# EasyEDA Pro project ProPrj_通用工程PCB-Update-V3.1_2025-07-16.epro, board [PCB]Core_Board
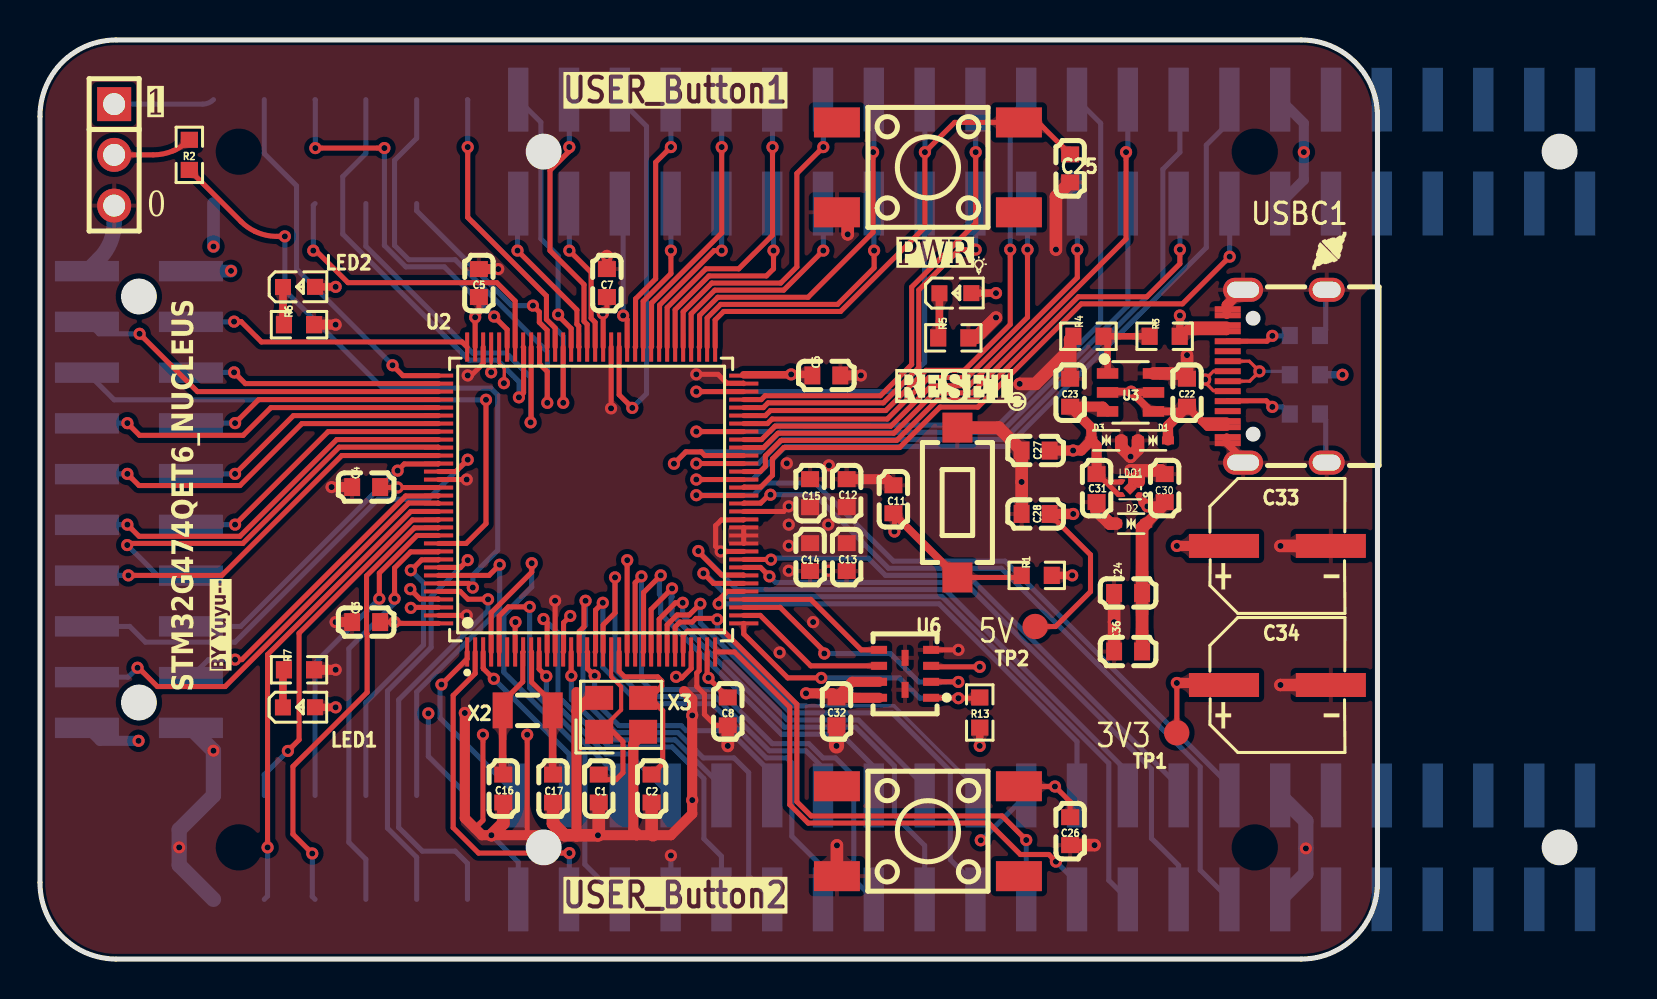
[diagram p7: board, top side]
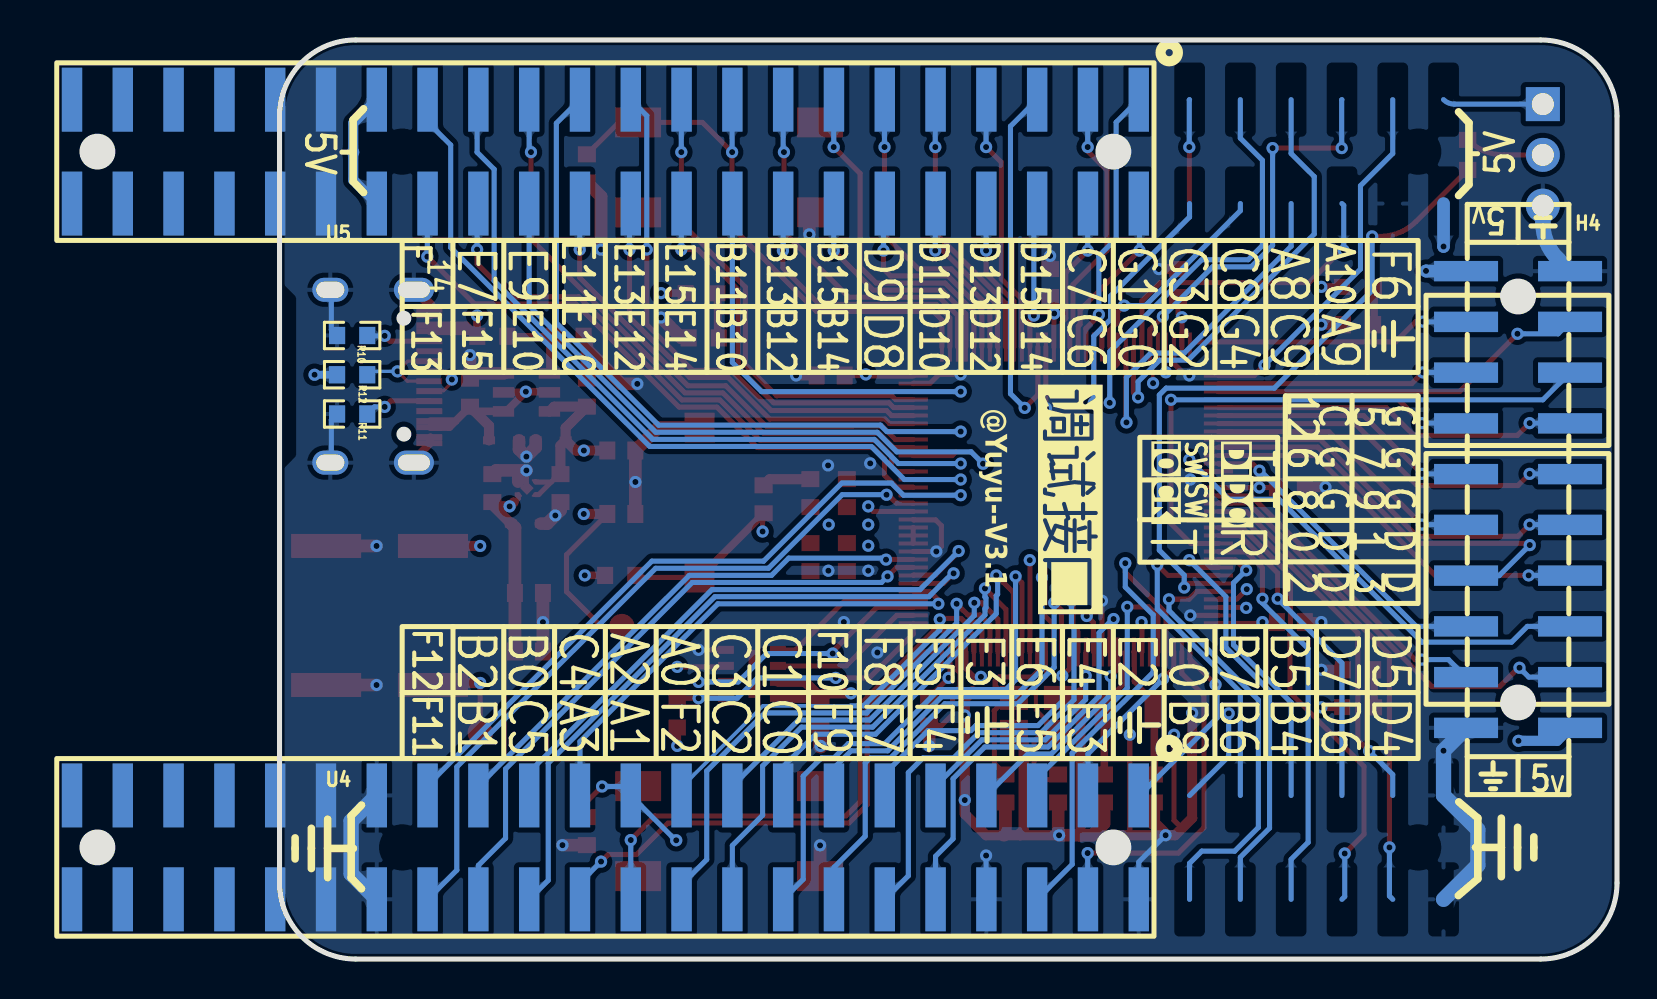
[diagram p8: board, bottom side, seen from below]

Outline 76.88 x 46 mm; copper layers: Top Layer, GND, PWR, Bottom Layer. Coordinates in mm from the lower left corner of the outline.
Outline path: 0,42.19 0,3.81 arc(1.12,1.12) 3.81,0 63.07,0 arc(65.76,1.12) 66.88,3.81 66.88,42.19 arc(65.76,44.88) 63.07,46 3.81,46 arc(1.12,44.88) 0,42.19
Stack: Top Layer 0.035mm 外层铜厚1oz / Dielectric1 0.2104mm 7628 RC49% 8.6mil / GND 0.0152mm 内层铜厚 / Dielectric2 1.065mm 1.1mm H/HOZ Copper / PWR 0.0152mm 内层铜厚 / Dielectric3 0.2104mm 7628 RC49% 8.6mil / Bottom Layer 0.035mm 外层铜厚1oz

## Design rules (mm)
net 8M_IN: DP2
net 8M_OUT: DP2
net L_IN: DP1
net L_OUT: DP1
net USB-DM: DP3
net USB-DP: DP3
net A5-SPI1_CLK: DP4
net A7-SPI1_MOSI: DP4
template: 自定义配置
spacing copperThickness1oz (default): track to track 0.102, other pairs 0.152 to 0.3
spacing copperThickness2oz: track to track 0.203, other pairs 0.152 to 0.3
track width copperThickness1oz (default): min 0.127, default 0.254, max 2.54
track width copperThickness2oz: min 0.203, default 0.254, max 2.54
differential pair differentialPair (default): width min 0.127, default 0.254, max 2.54; gap min 0.152, default 0.152
via viaSize (default): diameter min 0.5, default 0.61, max 10; hole min 0.3, default 0.305, max 6.3
net 3V3 uses copperRegion1

## Placement (name value [footprint] x y rotation side)
C1  20pF  [C0603]  27.94 8.53 90 top
C2  20pF  [C0603]  30.58 8.53 90 top
C3  100nF  [C0603]  16.31 16.87 180 top
C4  100nF  [C0603]  16.31 23.62 180 top
C5  100nF  [C0603]  21.95 33.83 90 top
C6  100nF  [C0603]  39.32 29.21 0 top
C7  100nF  [C0603]  28.35 33.83 90 top
C8  100nF  [C0603]  34.39 12.39 270 top
C11  100nF  [C0603]  42.67 23.01 90 top
C12  1uF  [C0603]  40.34 23.32 90 top
C13  1uF  [C0603]  40.34 20.12 270 top
C14  100nF  [C0603]  38.51 20.12 90 top
C15  10nF  [C0603]  38.51 23.32 90 top
C16  20pF  [C0603]  23.16 8.53 90 top
C17  20pF  [C0603]  25.65 8.53 90 top
C22  10uF  [C0603]  57.35 28.35 270 top
C23  10uF  [C0603]  51.51 28.35 270 top
C24  100nF  [C0603]  54.41 18.32 0 top
C25  100nF  [C0603]  51.51 39.57 270 top
C26  100nF  [C0603]  51.51 6.4 270 top
C27  100nF  [C0603]  49.78 25.45 180 top
C28  100nF  [C0603]  49.78 22.28 180 top
C30  1uF  [C0603]  56.24 23.57 270 top
C31  1uF  [C0603]  52.83 23.57 270 top
C32  100nF  [C0603]  39.83 12.39 270 top
C33  470uF  [CAP-SMD_BD6.3-L6.6-W6.6-FD]  61.87 20.68 0 top
C34  470uF  [CAP-SMD_BD6.3-L6.6-W6.6-FD]  61.87 13.72 0 top
C36  100nF  [C0603]  54.41 15.39 0 top
D1  EDS  [SOD-523_L1.2-W0.8-LS1.6-BI]  55.65 25.96 0 top
D2  EDS  [SOD-523_L1.2-W0.8-LS1.6-BI]  54.56 21.79 0 top
D3  EDS  [SOD-523_L1.2-W0.8-LS1.6-BI]  53.32 25.96 180 top
H2  -  [HDR-TH_3P-P2.54-V-M]  3.71 40.25 270 top
H4  HX PZ2.54-2x10P TP-D  [HDR-SMD_20P-P2.54-V-M-R2-C10-S2.54-LS7.5-EH]  4.95 23 270 bottom
LDO1  TPS7A2033PDQNR  [X2SON-4_L1.0-W1.0-P0.65-TL-EP]  54.51 23.57 180 top
LED0  LTST-C191KSKT  [LED0603-RD-YELLOW]  45.77 33.32 0 top
LED1  LTST-C191KSKT  [LED0603-RD-YELLOW]  12.95 12.6 0 top
LED2  LTST-C191KSKT  [LED0603-RD-YELLOW]  12.95 33.64 0 top
R1  10K  [R0603]  49.84 19.2 0 top
R2  10K  [R0603]  7.47 40.25 270 top
R3  100K  [R0603]  56.24 31.17 0 top
R4  30K  [R0603]  52.43 31.17 0 top
R5  1K  [R0603]  45.67 31.09 0 top
R6  1K  [R0603]  12.95 31.75 0 top
R7  1K  [R0603]  12.95 14.48 0 top
R10  5.1K  [R0603]  63.25 31.21 180 bottom
R11  5.1K  [R0603]  63.25 27.28 180 bottom
R12  1.5K  [R0603]  63.25 29.24 0 bottom
R13  10K  [R0603]  46.99 12.34 270 top
SW0  ZX-QC36-4.3TPWD  [KEY-SMD_L6.0-W3.5-LS8.0]  45.87 22.85 90 top
TP1  -  [Test-Point-0.5mm]  56.84 11.32 0 top
TP2  -  [Test-Point-0.5mm]  49.76 16.64 0 top
U2  STM32G474QET6  [LQFP-128_L14.0-W14.0-P0.40-LS16.0-BL]  27.56 23 0 top
U3  PW2609  [SOT-23-6_L2.9-W1.6-P0.95-LS2.8-BL]  54.53 28.36 270 top
U4  -  [贴片排针-定位柱 2x22p]  35.34 5.59 0 bottom
U5  -  [贴片排针-定位柱 2x22p]  35.34 40.41 0 bottom
U6  W25Q64JWUUIQ  [USON-8_L4.0-W3.0-P0.80-BL_WINBOND_UU]  43.26 14.27 90 top
USBC1  TYPE-C-31-M-12  [USB-C_SMD-TYPE-C-31-M-12]  61.86 29.17 90 top
USW1  KH-6X6X5H-STM  [SW-SMD_4P-L6.0-W6.0-P4.50-LS9.0_H5.0]  44.4 39.62 180 top
USW2  KH-6X6X5H-STM  [SW-SMD_4P-L6.0-W6.0-P4.50-LS9.0_H5.0]  44.4 6.4 180 top
X2  32.768kHz  [FC-135R_L3.2-W1.5]  24.38 12.45 180 top
X3  8MHz  [CRYSTAL-SMD_4P-L3.2-W2.5-BL]  29.06 12.22 0 top

## Footprints (pads in the part's own frame, mm; a bottom-side part is the same pattern mirrored in y, then rotated)
C0603
  rect 0.8x0.9 smd: 1(-0.7,0) 2(0.7,0)
CAP-SMD_BD6.3-L6.6-W6.6-FD
  rect 3.5x1.2 smd: 1(-2.67,0) 2(2.67,0)
CRYSTAL-SMD_4P-L3.2-W2.5-BL
  rect 1.4x1.2 smd: 1(-1.1,-0.85) 2(1.1,-0.85) 3(1.1,0.85) 4(-1.1,0.85)
FC-135R_L3.2-W1.5
  rect 1x1.8 smd: 1(-1.25,0) 2(1.25,0)
HDR-SMD_20P-P2.54-V-M-R2-C10-S2.54-LS7.5-EH
  rect 1.02x3.2 smd: 1(-11.43,-2.6) 2(-11.43,2.6) 3(-8.89,-2.6) 4(-8.89,2.6) 5(-6.35,-2.6) 6(-6.35,2.6) 7(-3.81,-2.6) 8(-3.81,2.6) 9(-1.27,-2.6) 10(-1.27,2.6) 11(1.27,-2.6) 12(1.27,2.6) 13(3.81,-2.6) 14(3.81,2.6) 15(6.35,-2.6) 16(6.35,2.6) 17(8.89,-2.6) 18(8.89,2.6) 19(11.43,-2.6) 20(11.43,2.6)
HDR-TH_3P-P2.54-V-M
  rect 1.7x1.7 hole 1.1: 1(-2.54,0)
  round 1.7 hole 1.1: 2(0,0) 3(2.54,0)
KEY-SMD_L6.0-W3.5-LS8.0
  rect 1.5x1.5 smd: 1(-3.75,0) 2(3.75,0)
LED0603-RD-YELLOW
  rect 0.8x0.8 smd: 1(-0.799,-0.004) 2(0.799,0.004)
LQFP-128_L14.0-W14.0-P0.40-LS16.0-BL
  rect 0.2x1.46 smd: 1(-6.2,-7.63) 2(-5.8,-7.63) 3(-5.4,-7.63) 4(-5,-7.63) 5(-4.6,-7.63) 6(-4.2,-7.63) 7(-3.8,-7.63) 8(-3.4,-7.63) 9(-3,-7.63) 10(-2.6,-7.63) 11(-2.2,-7.63) 12(-1.8,-7.63) 13(-1.4,-7.63) 14(-1,-7.63) 15(-0.6,-7.63) 16(-0.2,-7.63) 17(0.2,-7.63) 18(0.6,-7.63) 19(1,-7.63) 20(1.4,-7.63) 21(1.8,-7.63) 22(2.2,-7.63) 23(2.6,-7.63) 24(3,-7.63) 25(3.4,-7.63) 26(3.8,-7.63) 27(4.2,-7.63) 28(4.6,-7.63) 29(5,-7.63) 30(5.4,-7.63) 31(5.8,-7.63) 32(6.2,-7.63) 65(6.2,7.63) 66(5.8,7.63) 67(5.4,7.63) 68(5,7.63) 69(4.6,7.63) 70(4.2,7.63) 71(3.8,7.63) 72(3.4,7.63) 73(3,7.63) 74(2.6,7.63) 75(2.2,7.63) 76(1.8,7.63) 77(1.4,7.63) 78(1,7.63) 79(0.6,7.63) 80(0.2,7.63) 81(-0.2,7.63) 82(-0.6,7.63) 83(-1,7.63) 84(-1.4,7.63) 85(-1.8,7.63) 86(-2.2,7.63) 87(-2.6,7.63) 88(-3,7.63) 89(-3.4,7.63) 90(-3.8,7.63) 91(-4.2,7.63) 92(-4.6,7.63) 93(-5,7.63) 94(-5.4,7.63) 95(-5.8,7.63) 96(-6.2,7.63)
  rect 1.46x0.2 smd: 33(7.63,-6.2) 34(7.63,-5.8) 35(7.63,-5.4) 36(7.63,-5) 37(7.63,-4.6) 38(7.63,-4.2) 39(7.63,-3.8) 40(7.63,-3.4) 41(7.63,-3) 42(7.63,-2.6) 43(7.63,-2.2) 44(7.63,-1.8) 45(7.63,-1.4) 46(7.63,-1) 47(7.63,-0.6) 48(7.63,-0.2) 49(7.63,0.2) 50(7.63,0.6) 51(7.63,1) 52(7.63,1.4) 53(7.63,1.8) 54(7.63,2.2) 55(7.63,2.6) 56(7.63,3) 57(7.63,3.4) 58(7.63,3.8) 59(7.63,4.2) 60(7.63,4.6) 61(7.63,5) 62(7.63,5.4) 63(7.63,5.8) 64(7.63,6.2) 97(-7.63,6.2) 98(-7.63,5.8) 99(-7.63,5.4) 100(-7.63,5) 101(-7.63,4.6) 102(-7.63,4.2) 103(-7.63,3.8) 104(-7.63,3.4) 105(-7.63,3) 106(-7.63,2.6) 107(-7.63,2.2) 108(-7.63,1.8) 109(-7.63,1.4) 110(-7.63,1) 111(-7.63,0.6) 112(-7.63,0.2) 113(-7.63,-0.2) 114(-7.63,-0.6) 115(-7.63,-1) 116(-7.63,-1.4) 117(-7.63,-1.8) 118(-7.63,-2.2) 119(-7.63,-2.6) 120(-7.63,-3) 121(-7.63,-3.4) 122(-7.63,-3.8) 123(-7.63,-4.2) 124(-7.63,-4.6) 125(-7.63,-5) 126(-7.63,-5.4) 127(-7.63,-5.8) 128(-7.63,-6.2)
R0603
  rect 0.806x0.864 smd: 1(-0.753,0) 2(0.753,0)
SOD-523_L1.2-W0.8-LS1.6-BI
  rect 0.6x0.4 smd: 1(-0.75,0) 2(0.75,0)
SOT-23-6_L2.9-W1.6-P0.95-LS2.8-BL
  rect 0.532x1.072 smd: 1(-0.95,-1.149) 2(0,-1.149) 3(0.95,-1.149) 4(0.95,1.149) 5(0,1.149) 6(-0.95,1.149)
SW-SMD_4P-L6.0-W6.0-P4.50-LS9.0_H5.0
  rect 2.3x1.5 smd: 1(-4.55,2.25) 2(4.55,2.25) 3(-4.55,-2.25) 4(4.55,-2.25)
Test-Point-0.5mm
  round 1.27 smd: 1(0,0)
USB-C_SMD-TYPE-C-31-M-12
  oval 1.2x2 hole 0.8x1.6: 0(-4.325,1.706) 1(4.325,1.706)
  oval 1.2x1.8 hole 0.8x1.4: 2(4.325,-2.474) 3(-4.325,-2.474)
  rect 0.3x1.3 smd: A1(-3.35,2.474) A4(-2.55,2.474) A5(-1.25,2.474) A6(-0.25,2.474) A7(0.25,2.474) A8(1.25,2.474) A9(2.55,2.474) A12(3.35,2.474) B1(3.05,2.474) B4(2.25,2.474) B5(1.75,2.474) B6(0.75,2.474) B7(-0.75,2.474) B8(-1.75,2.474) B9(-2.25,2.474) B12(-3.05,2.474)
USON-8_L4.0-W3.0-P0.80-BL_WINBOND_UU
  rect 0.4x0.8 smd: 1(-1.2,-1.3) 2(-0.4,-1.3) 3(0.4,-1.3) 4(1.2,-1.3) 5(1.2,1.3) 6(0.4,1.3) 7(-0.4,1.3) 8(-1.2,1.3)
  rect 0.8x0.35 smd: 9(-0.802,0) 10(0.798,0)
X2SON-4_L1.0-W1.0-P0.65-TL-EP
  custom 0.36x0.22 smd: 1(-0.43,0.325) 2(-0.43,-0.325) 3(0.43,-0.325) 4(0.43,0.325)
  rect 0.48x0.48 smd rot 45: 5(0,0)
贴片排针-定位柱 2x22p
  rect 1.02x3.2 smd: 1(-11.43,-2.6) 2(-8.89,-2.6) 3(-6.35,-2.6) 4(-3.81,-2.6) 5(-1.27,-2.6) 6(1.27,-2.6) 7(3.81,-2.6) 8(6.35,-2.6) 9(8.89,-2.6) 10(11.43,-2.6) 11(13.97,-2.6) 12(16.51,-2.6) 13(19.05,-2.6) 14(21.59,-2.6) 15(24.13,-2.6) 16(26.67,-2.6) 17(29.21,-2.6) 18(31.75,-2.6) 19(34.29,-2.6) 20(36.83,-2.6) 21(39.37,-2.6) 22(41.91,-2.6) 23(-11.43,2.6) 24(-8.89,2.6) 25(-6.35,2.6) 26(-3.81,2.6) 27(-1.27,2.6) 28(1.27,2.6) 29(3.81,2.6) 30(6.35,2.6) 31(8.89,2.6) 32(11.43,2.6) 33(13.97,2.6) 34(16.51,2.6) 35(19.05,2.6) 36(21.59,2.6) 37(24.13,2.6) 38(26.67,2.6) 39(29.21,2.6) 40(31.75,2.6) 41(34.29,2.6) 42(36.83,2.6) 43(39.37,2.6) 44(41.91,2.6)

## Nets
As in the schematic.

Pads without a net: U2 6; USBC1 A8 B8; USW1 1 4; USW2 1 4

## Via types
v1: diameter 0.61, hole 0.305, Top Layer to Bottom Layer, 192 vias

## Routing (per net, layer and track width the routed paths; a pad name or vN(x,y) marks a point on that pad's centre or on a via; arc(x,y) is an arc through that point)
3V3: length 52.2
  Top Layer w0.254: U2.95 v1(21.76,32.12) 21.95,32.31 C5.1 ; C3.1 v1(17.73,16.87) 17.79,16.8 U2.128 ; C7.1 28.35,32.51 v1(28.14,32.31) 28.16,32.29 U2.79 ; TP1.1 56.84,11.33 v1(56.84,13.82) ; C8.1 33.42,14.06 v1(33.42,14.07) 33.36,14.14 U2.31 ; U2.111 v1(17.88,23.6) 17.03,23.6 C4.1 ; U2.47 37.18,22.4 v1(37.44,22.66) ; U2.13 26.18,15.39 26.18,16.84 v1(26.51,17.17) ; v1(46.99,14.62) 44.61,14.62 U6.3 ; LDO1.1 54.94,23.05 55.13,22.86 55.17,22.86 ; U2.43 U2.44 U2.45
  Top Layer w0.381: LED0.2 v1(47.8,33.33) ; R13.2 v1(46.99,10.67) ; 35.19,29.24 37.54,29.24 v1(37.56,29.26) 38.57,29.26 C6.1 ; R1.2 v1(51.61,19.2)
  Top Layer w0.508: C33.1 v1(56.84,20.68) ; D2.2 56.24,22.72 C30.2 56.02,22.66 v1(55.37,22.66) 55.17,22.86 ; U6.7 40.61,13.87 C32.1 39.62,13.3 v1(38.3,13.3) ; v1(56.84,13.82) 59.1,13.82 C34.1 ; U6.8 39.85,13.07
  Top Layer w0.635: D2.2 55.11,21.59 C24.2 C36.2
  Bottom Layer w0.381: R12.2 v1(65.13,29.24)
  vias: v1(37.44,21.74) v1(37.44,20.69) v1(39.42,21.74)
5V: length 20.1
  Top Layer w0.254: C31.1 52.89,24.27 53.29,23.87 ; LDO1.3 54.06,23.87 53.29,23.87 ; LDO1.4 53.92,23.25 53.29,23.87 ; C28.1 52.53,20.23 52.53,18.39 50.78,16.64 TP2.1
  Top Layer w0.508: C28.1 v1(51.66,22.28) ; D3.2 52.06,25.45 v1(51.66,25.45) C27.1 ; D3.2 52.57,26.59 C23.2 53.14,27.65 U3.3 ; D3.2 52.83,25.7 C31.1
GND: length 163.3
  Top Layer w0.254: U2.110 v1(21.34,24) ; U2.12 25.76,17.93 v1(25.76,17.93) ; v1(24.36,11.23) 24.36,6.21 24.38,6.2 ; 21.75,6.55 22.15,6.95 v1(22.15,11.23) ; 44.56,15.47 v1(45.92,15.47) ; U2.94 22.16,29.81 21.56,29.21 v1(21.39,29.21) ; v1(28.55,27.56) 28.56,27.57 U2.78 ; C8.2 33.77,11.69 33.22,12.24 33.22,13.26 32.84,13.64 32.84,14.32 32.96,14.43 U2.30 ; U2.127 v1(21.34,17.2) ; v1(54.53,24.45) 54.53,24.13 54.54,24.12 54.54,23.81 54.53,23.8 54.53,23.59 LDO1.5 ; v1(32.82,29.26) 33.9,29.26 34.34,28.82 35.17,28.82 U2.63 ; U2.42 v1(34.04,20.4) 33.78,20.65 33.78,21.69 34.07,21.98 35.17,21.98 U2.46
  Top Layer w0.381: 59.34,26.12 59.34,25.82 60.11,25.05 60.11,24.85 ; 59.34,32.22 59.34,32.52
  Top Layer w0.508: X3.2 30.16,11.27 29.67,10.78 29.67,6.47 29.84,6.3 29.84,6.2 ; X3.4 27.49,13.07 26.83,12.41 ; R6.2 v1(14.78,31.75) ; C11.2 42.37,24.02 C12.2 ; 26.23,6.2 v1(22.57,6.2) 22.1,6.2 21.24,7.05 v1(21.24,12.32) ; C5.2 v1(22.91,34.53) ; 26.83,12.41 26.83,13.36 ; 26.83,12.41 26.83,6.2 ; C4.2 v1(14.58,23.62) ; 32.21,13.41 32.61,13 v1(32.61,12.19) v1(32.61,7.96) 32.61,7.26 31.55,6.2 29.84,6.2 ; 29.84,6.2 29.83,6.19 v1(27.9,6.19) ; 59.34,32.52 59.34,32.73 60.11,33.5 ; C3.2 v1(14.78,16.87) ; R7.2 v1(14.78,14.48) ; C7.2 v1(28.35,35.19) ; 40.02,29.21 v1(41.05,29.21)
  Top Layer w0.635: 39.85,4.15 v1(39.85,5.69) ; C8.2 v1(34.39,10.67) ; C33.2 v1(62.03,20.68) ; 51.51,30.52 51.51,31.01 R4.1 ; 51.51,30.52 C23.1 ; 51.51,30.52 49.78,28.79 v1(48.99,28.79) ; v1(57.35,30.23) C22.1 57.09,29.31 55.68,29.31 ; D3.1 54.07,25.61 v1(54.53,25.15) 54.9,25.52 D1.1 ; C31.2 52.83,22.45 v1(53.09,22.2) 53.49,21.79 53.81,21.79 ; v1(50.8,35.51) 50.8,38.16 C25.2 ; C28.2 v1(49.08,23.88) C27.2 47.94,26.6 45.87,26.6 ; C24.1 v1(53.71,16.86) C36.1 ; C30.1 56.05,24.45 v1(54.53,24.45) 54.94,24.05 LDO1.2 ; C2.1 30.58,6.27 30.65,6.2 ; C17.1 25.65,6.78 26.23,6.2 26.83,6.2 26.83,6.19 v1(27.9,6.19) 27.94,6.24 C1.1 ; v1(22.57,6.2) 23.16,6.79 C16.1 ; R5.2 46.79,31.09 v1(47.8,32.11) ; C34.2 v1(62.03,13.72) ; 39.85,37.37 40.39,36.84 v1(40.39,36.27) ; C26.2 v1(52.73,5.7)
  Top Layer w0.762: C32.2 v1(39.83,10.67)
  Bottom Layer w0.254: v1(22.57,6.2) 23.91,4.85 U4.23 ; 64.29,24.85 64.29,26.99 R11.1 ; R10.1 64.29,31.5 64.29,33.5 ; 31.53,2.99 31.55,3 v1(31.55,5.18)
  Bottom Layer w0.762: H4.19 7.55,11.55 v1(8.67,10.43) 8.67,8.19 6.96,6.47 v1(6.96,5.59) 6.96,4.7 8.67,2.99 ; H4.2 2.96,35.05 arc(3.52,35.87) 3.71,36.84 H2.3 ; 62.01,2.99 63.3,4.27 v1(63.3,5.54) 63.3,6.9 62.01,8.19
  vias: v1(36.98,15.34) v1(37.34,24.81) v1(37.44,19.44) v1(38.66,16.87) v1(39.45,24.71) v1(39.43,19.44)
VCC: length 34.5
  Top Layer w0.381: 59.34,31.72 57.54,31.72 57.23,31.41 59.33,31.41 59.34,31.42 ; v1(57,32.21) 57,31.18 R3.2 ; 55.68,28.36 54.6,28.36 55.55,27.41 57.12,27.41 ; U3.2 53.42,28.4 v1(54.56,28.4) ; 58.08,26.92 C22.2 ; 58.08,26.92 59.34,26.92 ; 58.08,26.92 58.38,26.62 59.34,26.62
  Top Layer w0.508: D1.2 56.4,26.69 57.12,27.41 C22.2
  Bottom Layer w0.254: H2.1 8.13,42.79 arc(8.43,42.85) 8.67,43.01
  Bottom Layer w0.508: 62.01,37.81 63.19,38.99 v1(63.19,40.39) 63.19,41.83 62.01,43.01 ; v1(4.93,10.92) 3,10.92 H4.20
  Bottom Layer w0.635: v1(9.55,34.44) 9.54,34.43 H4.1 ; 8.67,37.81 v1(8.67,35.66)
8M_IN: length 9.1
  Top Layer w0.203: U2.19 28.56,14.13 29.06,13.63 29.06,12.47 X3.1
  Top Layer w0.254: X3.1 28.66,11.37 29.15,10.88 29.15,9.32 28.8,8.98 28.19,8.98 C1.2
8M_OUT: length 9.1
  Top Layer w0.254: X3.3 30.5,13.07 ; 30.5,13.07 31.09,13.66 31.09,13.92 30.89,14.12 29.23,14.12 28.96,14.4 U2.20 ; 30.5,13.07 31.14,12.43 31.14,9.79 C2.2
A0: length 20.7
  Top Layer w0.254: U2.27 31.76,16.62 32,16.86 32.61,16.86 32.79,17.05 33.81,17.05 v1(33.86,17)
  Bottom Layer w0.178: 46.77,8.19 46.77,8.6 42.7,12.67 38.3,12.67
  Bottom Layer w0.254: 38.3,12.67 37.66,12.67 33.86,16.47 v1(33.86,17)
A1: length 28.2
  Top Layer w0.254: U2.28 32.16,16.19 32.38,16.41 34.18,16.41 37.85,12.75 37.85,7.87 38.56,7.16 48.11,7.16 v1(49.31,5.96)
  Bottom Layer w0.254: v1(49.31,5.96) 49.31,2.99
A2: length 28.9
  Top Layer w0.254: v1(31.81,14.12) 31.86,14.07 32.09,14.07 32.56,14.54 U2.29 ; USW2.3 48.96,8.64 v1(50.75,8.64) 51.51,7.87 C26.1
  GND w0.254: v1(31.81,14.12) 32.51,14.12 33.53,13.11 35.66,13.11 42.82,5.94 v1(47.04,5.94)
  Bottom Layer w0.254: v1(47.04,5.94) 47.07,5.94 49.31,8.19 49.76,8.64 v1(50.75,8.64)
A3: length 26.6
  Top Layer w0.254: v1(50.8,4.88) 50.44,5.23 49.02,5.23 47.45,6.81 38.41,6.81 37.49,7.73 37.49,12.6 34.72,15.37 U2.32
  Bottom Layer w0.254: 51.85,2.99 51.85,3.82 v1(50.8,4.88)
A4-SPI1_NSS: length 15.1
  Top Layer w0.254: v1(39.06,14.07) 37.39,14.07 35.19,16.27 U2.33 ; U6.1 45.9,13.07 v1(45.92,13.06) 46.95,13.06 R13.1
  Bottom Layer w0.254: v1(39.06,14.07) 42.98,14.07 43.99,13.06 v1(45.92,13.06)
A5-SPI1_CLK: length 7.8
  Top Layer w0.254: U6.6 38.54,14.67 36.01,17.2 U2.34
A6-SPI1_MISO: length 13.7
  Top Layer w0.254: v1(45.92,13.87) 45.92,13.87 U6.2 ; v1(39.22,15.29) 39.22,15.39 37.01,17.6 U2.35
  Bottom Layer w0.254: v1(45.92,13.87) 43.94,13.87 42.52,15.29 v1(39.22,15.29)
A7-SPI1_MOSI: length 7.8
  Top Layer w0.254: U2.36 38.54,18 41.07,15.47 41.96,15.47
A8: length 22.5
  Top Layer w0.254: v1(23.95,28.11) 24.18,28.35 24.18,30.61 U2.89
  Bottom Layer w0.254: v1(23.95,28.11) 23.95,28.9 22.87,29.97 21.45,29.97 15.14,36.28 15.14,39.16 16.29,40.32 16.29,43.01
A9: length 15.8
  Top Layer w0.254: v1(13.67,35.46) 13.79,35.46 15.4,33.85 22.84,33.85 23.76,32.93 U2.90
  Bottom Layer w0.254: v1(13.67,35.46) 13.67,37.72 13.75,37.81
A10: length 19.5
  Top Layer w0.254: v1(22.71,32.16) 23.36,31.5 U2.91 ; v1(17.22,40.59) v1(13.77,40.59)
  Bottom Layer w0.254: v1(13.77,40.59) 13.77,43 13.75,43.01 ; v1(17.22,40.59) 17.22,35.72 18.29,34.64 20.22,34.64 v1(22.71,32.16)
B0: length 30
  Top Layer w0.254: U2.39 35.17,19.22 34.08,19.22 32.92,20.38 v1(32.92,20.42)
  Bottom Layer w0.254: 54.39,8.19 54.39,9.35 45.25,18.49 34.85,18.49 v1(32.92,20.42)
B1: length 31.7
  Top Layer w0.254: v1(36.47,19.15) 36.03,19.6 U2.40
  Bottom Layer w0.254: 56.93,2.99 56.93,4.69 55.57,6.04 55.57,9.51 46.24,18.85 36.78,18.85 v1(36.47,19.15)
B2: length 27
  Top Layer w0.254: v1(36.55,19.99) 36.54,20 U2.41
  Bottom Layer w0.254: 56.93,8.19 56.93,8.66 46.39,19.2 42.28,19.2 41.41,20.07 36.63,20.07 v1(36.55,19.99)
B4: length 20.4
  Top Layer w0.254: U2.119 19.91,20.38 18.53,20.38 17.73,19.58 v1(17.73,18.03)
  Bottom Layer w0.254: 16.29,2.99 16.29,4.99 15.44,5.84 15.44,15.53 17.73,17.82 v1(17.73,18.03)
B5: length 14.3
  Top Layer w0.254: v1(18.54,19.46) 18.56,19.46 19.08,19.98 19.91,19.98 U2.120
  Bottom Layer w0.254: 16.29,8.19 16.29,12.84 19.18,15.72 19.18,18.82 v1(18.54,19.46)
B6: length 20.9
  Top Layer w0.254: U2.121 21.02,19.6 v1(21.39,19.96)
  Bottom Layer w0.254: v1(21.39,19.96) 19.56,18.14 19.56,15.6 17.37,13.42 17.37,6.55 18.83,5.09 18.83,2.99
B7: length 16.5
  Top Layer w0.254: U2.122 19.93,19.2 22.45,19.2 v1(22.99,19.74)
  Bottom Layer w0.254: v1(22.99,19.74) 22.99,17.52 18.83,13.37 18.83,8.19
B9: length 21.9
  Top Layer w0.254: U2.124 21.01,18.4 21.4,18.01 22.4,18.01 v1(22.4,18)
  Bottom Layer w0.254: 21.37,2.99 21.37,4.79 20.76,5.4 19.12,5.4 17.93,6.58 17.93,12.97 22.4,17.44 v1(22.4,18)
B10: length 22.3
  Top Layer w0.254: U2.62 v1(32.82,28.4)
  Bottom Layer w0.254: 44.23,37.81 44.23,29.86 42.78,28.4 v1(32.82,28.4)
B11: length 28.7
  Top Layer w0.254: C25.1 49.91,41.87 USW1.3 45.74,41.87 v1(44.25,40.39) 44.25,36.63 40.03,32.41 34.18,32.41 33.76,31.99 U2.65
  Bottom Layer w0.254: 44.23,43.01 44.25,43 v1(44.25,40.39)
B12: length 14.1
  Top Layer w0.254: U2.66 33.36,32.09 34.04,32.77 39.88,32.77 41.71,34.59 v1(41.71,35.46)
  Bottom Layer w0.254: v1(41.71,35.46) 41.69,35.47 41.69,37.81
B13: length 18.6
  Top Layer w0.254: U2.67 32.98,30.65 32.98,32.21 33.89,33.12 38.41,33.12 41.66,36.37 v1(41.66,40.39)
  Bottom Layer w0.254: 41.69,43.01 41.69,40.42 v1(41.66,40.39)
B14: length 11.9
  Top Layer w0.254: v1(39.17,35.46) 37.19,33.48 33.74,33.48 32.56,32.3 U2.68
  Bottom Layer w0.254: v1(39.17,35.46) 39.17,37.8 39.15,37.81
B15: length 17.3
  Top Layer w0.254: v1(39.17,40.64) 37.85,39.32 37.85,34.64 37.04,33.83 33.59,33.83 32.16,32.4 U2.69
  Bottom Layer w0.254: v1(39.17,40.64) 39.17,43 39.15,43.01
BOOT0: length 33.5
  Top Layer w0.254: R2.2 10.05,36.91 arc(10.38,36.64) 10.75,36.42 arc(11.28,36.23) 11.84,36.17 v1(12.24,36.17) ; U2.123 21.43,18.8 v1(21.64,18.59)
  Bottom Layer w0.254: v1(12.24,36.17) 12.24,33.46 17.13,28.57 22.54,28.57 22.88,28.23 22.88,20.46 21.64,19.22 v1(21.64,18.59)
C0: length 28.3
  Top Layer w0.254: v1(30.07,19.15) 29.76,18.84 U2.22
  Bottom Layer w0.254: 41.69,2.99 40.69,3.99 40.69,9.16 39.78,10.07 39.15,10.07 38.44,10.78 36.62,10.78 33.91,13.49 30.55,13.49 30.07,13.97 v1(30.07,19.15)
C1: length 21.4
  Top Layer w0.254: U2.23 30.18,15.39 30.18,18.34 v1(31.04,19.2)
  Bottom Layer w0.254: v1(31.04,19.2) 30.97,19.13 30.97,18.26 31.04,18.19 31.04,17.28 37.07,11.25 40.07,11.25 41.69,9.63 41.69,8.19
C2: length 26.5
  Top Layer w0.254: v1(31.6,18.55) 30.56,17.5 U2.24
  Bottom Layer w0.254: 44.23,2.99 44.23,5.68 42.72,7.19 42.72,9.66 40.78,11.61 37.22,11.61 31.6,17.22 31.6,17.54 31.55,17.59 31.55,18.07 31.6,18.12 v1(31.6,18.55)
C3: length 19.9
  Top Layer w0.254: v1(32.14,17.83) 31.78,17.83 30.96,17.01 U2.25
  Bottom Layer w0.254: 44.23,8.19 44.23,8.66 40.93,11.96 37.37,11.96 32.14,17.19 v1(32.14,17.83)
C4: length 25.1
  Top Layer w0.254: v1(33.93,17.78) 33.93,17.97 34.36,18.4 U2.37
  Bottom Layer w0.254: v1(33.93,17.78) 44.96,17.78 51.85,10.88 51.85,8.19
C5: length 33.6
  Top Layer w0.254: U2.38 33.68,18.8 v1(33.17,19.3)
  Bottom Layer w0.254: v1(33.17,19.3) 33.24,19.3 34.4,18.14 45.11,18.14 53.44,9.8 53.44,3.94 54.39,2.99
C6: length 7.7
  Top Layer w0.254: v1(26.47,35.46) 27.56,34.37 27.56,32.07 27.76,31.87 U2.80
  Bottom Layer w0.254: 26.45,37.81 26.47,37.8 v1(26.47,35.46)
C7: length 13.6
  Top Layer w0.254: v1(26.47,40.64) 26.47,40.44 25.5,39.47 25.5,35.46 27.2,33.76 27.2,31.92 27.36,31.76 U2.81
  Bottom Layer w0.254: 26.45,43.01 26.47,43 v1(26.47,40.64)
C8: length 23.1
  Top Layer w0.254: U2.87 24.98,30.61 24.98,29.78 25.37,29.4 v1(25.37,27.84)
  Bottom Layer w0.254: v1(25.37,27.84) 25.37,30.4 20.76,35 18.44,35 17.73,35.71 17.73,39.98 18.83,41.08 18.83,43.01
C9: length 19.1
  Top Layer w0.254: v1(24.53,26.86) 24.56,26.89 U2.88
  Bottom Layer w0.254: 16.29,37.81 16.29,35.67 21.64,30.33 23.32,30.33 24.53,29.11 24.53,26.86 v1(24.53,26.86)
C10-UART4_TX: length 12.9
  Top Layer w0.254: U2.100 10.93,28 v1(9.75,26.82)
  Bottom Layer w0.254: v1(9.75,26.82) 7.56,26.82 H4.7
C11-UART4_RX: length 18.4
  Top Layer w0.254: v1(4.37,26.82) 4.98,26.21 10.16,26.21 11.55,27.6 U2.101
  Bottom Layer w0.254: v1(4.37,26.82) 2.36,26.82 H4.8
C12: length 13.6
  Top Layer w0.254: v1(9.75,24.28) 12.67,27.2 U2.102
  Bottom Layer w0.254: v1(9.75,24.28) 7.56,24.28 H4.9
C13: length 23
  Top Layer w0.254: v1(23.77,16.87) 23.76,16.85 U2.7
  Top Layer w0.381: LED2.2 v1(14.78,33.64)
  GND w0.381: v1(14.78,33.64) 23.77,24.65 v1(23.77,16.87)
D0: length 15.8
  Top Layer w0.254: U2.108 19.91,24.78 18.22,24.78 v1(17.88,24.44)
  Bottom Layer w0.254: v1(17.88,24.44) 17.83,24.44 10.04,16.65 H4.15
D1: length 24.9
  Top Layer w0.254: U2.109 20.79,24.4 v1(21.39,24.99)
  Bottom Layer w0.254: v1(21.39,24.99) 19.41,23.01 16.9,23.01 9.75,15.86 5.27,15.86 4.48,16.65 H4.16
D2: length 16.1
  Top Layer w0.254: U2.112 19.91,23.18 18.29,23.18 10.09,14.99 9.6,14.99
  Bottom Layer w0.254: 9.6,14.99 8.42,14.99 H4.17
  vias: v1(9.75,14.99)
D3: length 22
  Top Layer w0.254: U2.113 19.91,22.82 18.44,22.82 9.26,13.64 5.87,13.64 4.93,14.58 v1(4.88,14.58)
  Bottom Layer w0.254: v1(4.88,14.58) 4.41,14.11 H4.18
D4: length 23.8
  Top Layer w0.254: v1(11.38,5.59) 11.38,15.24 18.54,22.4 U2.114
  Bottom Layer w0.254: 11.21,2.99 11.38,3.15 v1(11.38,5.59)
D5: length 18.2
  Top Layer w0.254: U2.115 19.91,21.98 18.62,21.98 12.95,16.31 12.95,10.97 v1(12.39,10.41)
  Bottom Layer w0.254: 11.21,8.19 11.21,9.23 v1(12.39,10.41)
D6: length 22.8
  Top Layer w0.254: U2.116 19.91,21.58 18.72,21.58 16.33,19.18 16.33,16.3 16.36,16.27 16.36,13.35 12.65,9.64 12.65,6.25 v1(13.61,5.28)
  Bottom Layer w0.254: v1(13.61,5.28) 13.61,3.13 13.75,2.99
D7: length 16.2
  Top Layer w0.254: v1(16.97,18.03) 16.97,19.32 18.85,21.2 U2.117
  Bottom Layer w0.254: 13.75,8.19 13.75,14.82 v1(16.97,18.03)
D8: length 10.9
  Top Layer w0.254: v1(36.68,35.46) 36.68,34.55 36.32,34.19 33.45,34.19 31.76,32.5 U2.70
  Bottom Layer w0.254: v1(36.68,35.46) 36.68,37.75 36.61,37.81
D9: length 15.5
  Top Layer w0.254: U2.71 31.36,32.61 33.3,34.55 34.94,34.55 36.63,36.23 v1(36.63,40.64)
  Bottom Layer w0.254: v1(36.63,40.64) 36.63,43 36.61,43.01
D10: length 8.7
  Top Layer w0.254: U2.72 30.98,30.65 30.98,32.73 33.71,35.46 v1(34.09,35.46)
  Bottom Layer w0.254: v1(34.09,35.46) 34.09,37.8 34.07,37.81
D11: length 13.8
  Top Layer w0.254: v1(34.09,40.64) 34.09,36.34 30.58,32.83 30.58,30.65 U2.73
  Bottom Layer w0.254: 34.07,43.01 34.09,43 v1(34.09,40.64)
D12: length 7.8
  Top Layer w0.254: v1(31.55,35.46) 31.55,34.3 30.16,32.92 U2.74
  Bottom Layer w0.254: 31.53,37.81 31.55,37.8 v1(31.55,35.46)
D13: length 13.1
  Top Layer w0.254: v1(31.55,40.64) 30.78,39.88 30.78,34.05 29.78,33.04 29.78,30.65 U2.75
  Bottom Layer w0.254: 31.53,43.01 31.55,43 v1(31.55,40.64)
D14: length 7.3
  Top Layer w0.254: v1(29.16,32.21) 29.36,32.01 U2.76
  Bottom Layer w0.254: 28.99,37.81 29.16,37.65 v1(29.16,32.21)
D15: length 19.6
  Top Layer w0.254: U2.77 28.96,28.24 v1(29.62,27.58)
  Bottom Layer w0.254: 28.99,43.01 30.33,41.68 30.33,28.3 v1(29.62,27.58)
E0: length 13.1
  Top Layer w0.254: v1(18.51,18.51) 19.01,18.02 19.91,18.02 U2.125
  GND w0.254: v1(18.51,18.51) 19.42,17.61 v1(19.42,12.29)
  Bottom Layer w0.254: 21.37,8.19 19.42,10.14 v1(19.42,12.29)
E1: length 9
  Top Layer w0.254: v1(18.54,17.58) 18.56,17.6 U2.126
  Top Layer w0.381: LED1.2 14.78,12.6 v1(14.78,12.6)
  GND w0.381: v1(18.54,17.58) 18.54,16.36 v1(14.78,12.6)
E2: length 9.4
  Top Layer w0.254: U2.1 21.36,15.02 v1(20.07,13.74)
  Bottom Layer w0.254: 23.91,8.19 23.88,8.19 20,12.06 20,13.67 v1(20.07,13.74)
E3: length 17.9
  Top Layer w0.254: v1(26.47,5.3) 21.93,5.3 20.66,6.58 20.66,13.19 21.76,14.29 U2.2
  Bottom Layer w0.254: v1(26.47,5.3) 26.47,3 26.45,2.99
E4: length 9
  Top Layer w0.254: U2.3 22.16,14.56 22.18,14.54 22.18,14.52 22.68,14.03 v1(22.69,14.03)
  Bottom Layer w0.254: 26.45,8.19 26.45,10.27 v1(22.69,14.03)
E5: length 25.1
  Top Layer w0.254: v1(24.59,19.81) 24.59,19.36 22.56,17.33 U2.4
  Bottom Layer w0.254: v1(24.59,19.81) 24.59,18.62 23.19,17.22 23.19,14.36 27.24,10.3 27.24,4.74 28.99,2.99
E6: length 14.8
  Top Layer w0.254: v1(24.49,17.63) 23.42,17.63 22.96,17.17 U2.5
  Bottom Layer w0.254: 28.99,8.19 28.99,9.06 24.49,13.56 v1(24.49,17.63)
E7: length 38.9
  Top Layer w0.254: U2.53 v1(32.82,24.8)
  Bottom Layer w0.254: v1(32.82,24.8) 35.93,24.8 37.14,26.01 48.21,26.01 56.15,33.94 56.15,39.53 57,40.38 57,42.95 56.93,43.01
E8: length 34.9
  Top Layer w0.254: U2.54 33.24,25.2 33.06,25.38 32.29,25.38 v1(31.7,24.79)
  Bottom Layer w0.254: v1(31.7,24.79) 32.29,25.38 36.01,25.38 36.99,26.37 48.07,26.37 54.39,32.69 54.39,37.81
E9: length 30.4
  Top Layer w0.254: U2.55 36.18,25.6 36.9,26.31 42.69,26.31 44.71,28.34 46.6,28.34 54.31,36.04 v1(54.31,40.39)
  Bottom Layer w0.254: v1(54.31,40.39) 54.39,40.47 54.39,43.01
E10: length 23.7
  Top Layer w0.254: v1(51.87,35.51) 51.87,34.1 46.46,28.69 44.56,28.69 42.54,26.67 36.75,26.67 36.08,26 U2.56
  Bottom Layer w0.254: 51.85,37.81 51.87,37.8 v1(51.87,35.51)
E11: length 36.5
  Top Layer w0.254: U2.57 v1(32.82,26.4)
  Bottom Layer w0.254: v1(32.82,26.4) 36.51,26.4 36.83,26.72 47.92,26.72 53.03,31.84 53.03,41.83 51.85,43.01
E12: length 22.1
  Top Layer w0.254: U2.58 36.38,26.8 36.6,27.03 42.37,27.03 44.45,29.11 46.37,29.11 49.38,32.12 v1(49.38,35.51)
  Bottom Layer w0.254: 49.31,37.81 49.38,37.75 v1(49.38,35.51)
E13: length 26.8
  Top Layer w0.254: U2.59 36.27,27.2 36.53,27.45 42.29,27.45 44.3,29.46 46.22,29.46 48.51,31.76 48.51,35.56
  Bottom Layer w0.254: 48.51,35.56 48.51,42.21 49.31,43.01
  vias: v1(48.51,35.51)
E14: length 19.5
  Top Layer w0.254: U2.60 36.17,27.6 36.41,27.84 42.17,27.84 43.94,29.61 43.94,33.49 45.96,35.51 v1(46.79,35.51)
  Bottom Layer w0.254: v1(46.79,35.51) 46.79,37.8 46.77,37.81
E15: length 23.7
  Top Layer w0.254: U2.61 36.06,28 36.26,28.19 42.02,28.19 43.59,29.76 43.59,33.63 46.79,36.83 v1(46.79,40.39)
  Bottom Layer w0.254: 46.77,43.01 46.79,43 v1(46.79,40.39)
F2: length 26.9
  Top Layer w0.254: U2.26 31.36,16.73 31.85,17.22 32.46,17.22 v1(33.02,17.78)
  Bottom Layer w0.254: 46.77,2.99 46.77,3.72 45.52,4.98 45.52,9.41 42.61,12.32 37.51,12.32 33.02,16.81 v1(33.02,17.78)
F3: length 10.6
  Top Layer w0.254: v1(25.32,14.15) 24.96,14.51 U2.10
  Bottom Layer w0.254: v1(25.32,14.15) 25.32,13.24 28.29,10.26 29.46,10.26 31.53,8.19
F4: length 21.3
  Top Layer w0.254: v1(25.18,17.02) 25.36,16.83 U2.11
  Bottom Layer w0.254: 34.07,2.99 34.07,5.14 33.2,6.02 33.2,9.03 31.61,10.62 28.44,10.62 25.9,13.16 25.9,16.33 25.21,17.02 v1(25.18,17.02)
F5: length 12.2
  Top Layer w0.254: v1(26.57,14.17) 26.56,14.18 U2.14
  Bottom Layer w0.254: 34.07,8.19 34.07,8.66 31.76,10.97 28.59,10.97 26.57,12.99 v1(26.57,14.17)
F6: length 18.5
  Top Layer w0.254: v1(17.63,29.72) 18.15,29.2 U2.97
  Bottom Layer w0.254: v1(17.63,29.72) 17.63,29.73 12.83,34.53 12.83,38.7 11.21,40.32 11.21,43.01
F7: length 24.3
  Top Layer w0.254: U2.15 26.96,16.38 27.2,16.62 27.2,17.85 v1(27.28,17.93)
  Bottom Layer w0.254: v1(27.28,17.93) 27.28,16.7 27.15,16.58 27.15,12.98 28.8,11.33 31.9,11.33 33.17,10.07 34.7,10.07 35.44,9.33 35.44,4.17 36.61,2.99
F8: length 14.2
  Top Layer w0.254: U2.16 27.38,15.35 27.38,14.52 27.54,14.36 27.74,14.36 v1(27.74,14.18)
  Bottom Layer w0.254: 36.61,8.19 36.61,9.27 34.45,11.43 32.31,11.43 32.06,11.69 28.95,11.69 27.74,12.9 v1(27.74,14.18)
F9: length 24.8
  Top Layer w0.254: U2.17 27.78,15.39 27.78,17.47 v1(28.14,17.83)
  Bottom Layer w0.254: v1(28.14,17.83) 28.14,14.6 29.97,12.78 33.61,12.78 36.32,10.07 37.34,10.07 37.59,9.81 37.59,6.15 39.15,4.58 39.15,2.99
F10: length 22.4
  Top Layer w0.254: v1(28.75,19.1) 28.75,17.32 28.16,16.73 U2.18
  Bottom Layer w0.254: v1(28.75,19.1) 28.75,14.49 30.11,13.13 33.76,13.13 36.47,10.42 38.29,10.42 39.15,9.56 39.15,8.19
F11: length 35.9
  Top Layer w0.254: v1(36.53,23.24) 36.45,23.24 36.03,22.82 35.21,22.82 U2.48
  Bottom Layer w0.254: 59.47,2.99 58.01,4.45 58.01,9.61 48.07,19.56 42.42,19.56 38.74,23.24 36.53,23.24 v1(36.53,23.24)
F12: length 36.1
  Top Layer w0.254: v1(32.82,23.22) 32.83,23.2 U2.49
  Bottom Layer w0.254: 59.47,8.19 59.47,8.7 48.26,19.91 42.67,19.91 38.76,23.82 36.28,23.82 35.68,23.22 v1(32.82,23.22)
F13: length 32.2
  Top Layer w0.254: U2.50 35.21,23.62 36.03,23.62 36.63,24.21 36.63,25.04 37.19,25.6 42.98,25.6 45.01,27.63 46.9,27.63 52.06,32.79 57.12,32.79 v1(59.49,35.15)
  Bottom Layer w0.254: 59.47,37.81 59.49,37.8 v1(59.49,35.15)
F14: length 40.6
  Top Layer w0.254: U2.51 v1(32.82,24)
  Bottom Layer w0.254: v1(32.82,24) 35.63,24 37.29,25.65 48.36,25.65 58.32,35.61 58.32,40.74 59.47,41.9 59.47,43.01
F15: length 29.5
  Top Layer w0.254: v1(57,35.51) 57,34.8 55.35,33.15 51.92,33.15 46.75,27.98 44.86,27.98 42.84,25.96 37.04,25.96 36.27,25.19 36.27,24.66 36.01,24.4 U2.52
  Bottom Layer w0.254: 56.93,37.81 57,37.75 v1(57,35.51)
G0: length 8.5
  Top Layer w0.254: U2.82 26.94,30.65 26.94,31.68 26.85,31.77 26.85,32.49 v1(23.88,35.46)
  Bottom Layer w0.254: 23.91,37.81 23.88,37.77 v1(23.88,35.46)
G1: length 13.5
  Top Layer w0.254: U2.83 26.56,31.56 25.91,32.21 v1(25.91,32.26)
  Bottom Layer w0.254: 23.91,43.01 25.04,41.88 25.04,36.05 25.91,35.19 v1(25.91,32.26)
G2: length 14.7
  Top Layer w0.254: U2.84 26.16,27.84 v1(26.16,27.84)
  Bottom Layer w0.254: 21.37,37.81 21.37,37.13 25.32,33.18 25.32,32.02 26.16,31.18 v1(26.16,27.84)
G3: length 14.2
  Top Layer w0.254: v1(21.39,40.64) 21.39,37.12 25.32,33.18 25.32,32.02 25.76,31.58 U2.85
  Bottom Layer w0.254: v1(21.39,40.64) 21.39,43 21.37,43.01
G4: length 10.5
  Top Layer w0.254: U2.86 25.36,31.48 24.97,31.87 24.97,32.38 v1(24.65,32.71)
  Bottom Layer w0.254: 18.83,37.81 18.83,37.45 23.58,32.71 v1(24.65,32.71)
G5: length 19.1
  Top Layer w0.254: v1(4.37,24.28) 4.95,23.7 10,23.7 13.1,26.8 U2.103
  Bottom Layer w0.254: v1(4.37,24.28) 2.36,24.28 H4.10
G6: length 14.3
  Top Layer w0.254: U2.104 14.41,26.4 v1(9.75,21.74)
  Bottom Layer w0.254: H4.11 7.56,21.74 v1(9.75,21.74)
G7: length 19.8
  Top Layer w0.254: v1(4.37,21.74) 4.95,21.16 10,21.16 14.84,26 U2.105
  Bottom Layer w0.254: v1(4.37,21.74) 2.36,21.74 H4.12
G8: length 21.4
  Top Layer w0.254: U2.106 19.91,25.62 14.96,25.62 10.14,20.8 4.44,20.8 v1(4.36,20.72)
  Bottom Layer w0.254: v1(4.36,20.72) 5.89,19.19 H4.13
G9: length 20.1
  Top Layer w0.254: v1(4.42,19.2) 9.09,19.2 15.09,25.2 U2.107
  Bottom Layer w0.254: H4.14 2.36,19.2 v1(4.42,19.2)
L_IN: length 6.6
  Top Layer w0.254: U2.8 24.14,15.35 24.14,13.88 23.13,12.87 X2.2
  Top Layer w0.381: C16.2 23.13,9.27 X2.2
L_OUT: length 6.6
  Top Layer w0.254: 24.57,15.37 24.58,15.36 24.58,13.86 25.63,12.81 X2.1
  Top Layer w0.381: X2.1 25.63,9.25 C17.2
NRST: length 29.2
  Top Layer w0.254: U2.21 29.36,19.96 v1(29.36,19.96) ; 42.72,22.25 v1(42.72,21.4) ; SW0.1 48.98,19.1 R1.1
  Top Layer w0.381: SW0.1 42.72,22.25 42.72,22.26 C11.1
  GND w0.381: v1(42.72,21.4) 42.72,19.96 41.26,18.5 32.95,18.5 31.49,19.96 v1(29.36,19.96)
SWCLK-TCK: length 12.6
  Top Layer w0.254: v1(9.7,29.36) 10.27,28.8 U2.98
  Bottom Layer w0.254: v1(9.7,29.36) 7.56,29.36 H4.5
SWDIO-TMS: length 14.3
  Top Layer w0.254: U2.96 21.1,30.89 11.07,30.89 10.06,31.9 v1(9.7,31.9)
  Bottom Layer w0.254: H4.3 9.69,31.89 v1(9.7,31.9)
TDI: length 19
  Top Layer w0.254: v1(4.98,31.29) 7.87,28.4 U2.99
  Bottom Layer w0.254: v1(4.98,31.29) 2.94,31.29 H4.4
TDO: length 29.5
  Top Layer w0.254: v1(22.3,27.99) 22.3,21.79 21.31,20.8 U2.118
  Bottom Layer w0.254: v1(22.3,27.99) 3.71,27.99 H4.6
USB-DM: length 46.6
  Top Layer w0.161: U2.92 22.96,29.82 23.22,29.57 23.22,28.84 v1(23.2,28.82) ; USBC1.A7 58.68,29.42 v1(58.26,29) 58.26,28.86 58.67,28.45 59.36,28.45 USBC1.B7
  GND w0.161: v1(58.26,29) 55.32,29 53.95,30.38 47.24,30.38 47.12,30.26 47.12,29.73 47.01,29.62 45.71,29.62 45.6,29.73 45.6,30.26 45.49,30.38 44.19,30.38 44.08,30.26 44.08,29.73 43.96,29.62 42.67,29.62 42.55,29.73 42.55,30.26 42.44,30.38 41.14,30.38 41.03,30.26 41.03,29.91 40.91,29.79 39.62,29.79 39.5,29.91 39.5,30.26 39.39,30.38 38.09,30.38 37.98,30.26 37.98,29.97 37.87,29.86 36.57,29.86 36.46,29.97 36.46,30.26 36.34,30.38 35.05,30.38 34.93,30.26 34.93,29.73 34.82,29.62 33.52,29.62 33.41,29.73 33.41,30.26 33.29,30.38 24.45,30.38 23.59,29.52 23.59,29.22 v1(23.2,28.82)
USB-DP: length 46.6
  Top Layer w0.161: U2.93 v1(22.56,29.37) ; USBC1.A6 60.49,28.92 v1(60.98,29.41) 60.47,29.92 USBC1.B6
  GND w0.161: v1(60.98,29.41) 60.5,29.9 57.85,29.9 57.59,29.64 55.26,29.64 53.66,31.24 24.74,31.24 23.26,29.76 22.95,29.76 v1(22.56,29.37)
  Bottom Layer w0.161: v1(60.98,29.41) 62.32,29.41 R12.1
$1N4520: length 4
  Top Layer w0.254: H2.2 5.66,40.25 arc(6.17,40.3) 6.66,40.45 arc(6.71,40.47) 6.76,40.5 arc(7.13,40.72) 7.46,40.99 R2.1
$1N4873: length 1.9
  Top Layer w0.381: LED1.1 12.15,14.43 R7.1
$1N4875: length 1.9
  Top Layer w0.381: LED2.1 12.15,31.8 R6.1
$1N5105: length 2.3
  Top Layer w0.381: R5.1 44.97,31.15 LED0.1
$1N6493: length 3.3
  Top Layer w0.254: v1(61.62,31.19) 61.35,30.92 59.34,30.92
  Bottom Layer w0.254: R10.2 62.48,31.19 v1(61.62,31.19)
$1N6557: length 3.4
  Top Layer w0.254: 59.34,27.92 59.36,27.94 61.32,27.94 v1(61.62,27.63)
  Bottom Layer w0.254: v1(61.62,27.63) 62.14,27.63 R11.2
$1N6882: length 4.2
  Top Layer w0.33: R3.1 R4.2 53.38,30.97 U3.1

## Copper pours and planes (outline as drawn; the poured copper is in the pictures)
3V3 on Top Layer: 34.34,21.89 36.37,21.89 36.73,22.25 36.73,22.91 37.03,23.22 37.74,23.22 37.8,23.16 37.8,20.4 36.65,20.4 36.58,20.47 34.65,20.47 34.39,20.73 34.39,21.54 34.34,21.59
3V3 on Top Layer: 36.98,23.32 41.38,23.32 41.38,20.12 36.98,20.12
3V3 on PWR: 12.09,35.31 9.75,32.97 9.75,8.23 12.6,5.38 58.57,5.38 61.87,8.69 61.87,24.15 61.33,24.7 55.86,24.7 55.14,23.98 55.14,23.61 54.79,23.26 54.79,22.17 53.87,22.17 52.48,20.78 49.89,20.78 49.38,21.28 49.38,33.12 47.19,35.31
3V3 on PWR: 57.91,32.92 66.7,32.92 66.7,10.31 57.91,10.31
5V on PWR: 49.68,30.12 52.38,30.12 52.78,29.72 52.78,27.18 53.39,26.57 53.39,25.3 54.46,24.23 54.61,24.23 54.61,22.55 54.46,22.4 53.39,22.4 52.02,21.03 49.89,21.03 49.68,21.23
GND on Top Layer: 37.05,19.84 41.25,19.84 41.25,18.44 37.05,18.44
GND on Top Layer: 36.98,25.09 41.55,25.09 41.55,23.57 36.98,23.57
GND on Top Layer: -2.23,48.16 71.68,48.16 71.68,-5.18 -2.23,-5.18
GND on Bottom Layer: -2.13,47.8 70.1,47.8 70.1,-4.32 -2.13,-4.32
GND on GND: -11.02,51.46 86.56,51.46 86.56,-11.89 -11.02,-11.89
VCC on PWR: 2.27,44.7 63.09,44.7 64.11,43.69 64.11,36.88 62.38,35.15 62.38,26.47 61.62,25.7 54.97,25.7 53.08,27.74 53.08,29.82 47.39,35.51 11.53,35.51 9.45,33.43 9.45,11.63 8.13,10.31 3.03,10.31 2.27,11.08

Small or netless copper shapes (teardrops, artwork), in the pictures only: 271 on Top Layer, 201 on Bottom Layer, 14 on GND

## Text on the board
Bottom Silkscreen Layer: V | SW | 14 | T | 5 | A10 | D14 | D15 | D12 | D13 | D10 | D11 | F10 | B14 | B15 | B12 | B13 | B10 | B11 | E14 | E15 | E12 | E13 | E10 | F15 | F11 | F12 | F13 | F | 5V | 7 | 9 | 1 | 3 | 12 | 6 | 8 | 0 | 2 | G | D | C | E11 | D4 | D5 | F6 | D6 | D7 | A9 | B4 | B5 | C9 | A8 | B6 | B7 | G4 | C8 | B9 | E0 | G2 | G3 | E2 | G0 | G1 | E3 | E4 | C6 | C7 | E5 | E6 | F3 | F4 | F5 | F7 | F8 | D8 | D9 | F9 | C0 | C1 | C2 | C3 | F2 | A0 | A1 | A2 | A3 | C4 | C5 | B0 | E9 | B1 | B2 | E7 | R | IO | CK | DI | DO | 调试接口 | @Yuyu--V3.1
Top Silkscreen Layer: 5V | 3V3 | USER_Button1 | USER_Button2 | PWR | RESET | 1 | 0 | STM32G474QET6_NUCLEUS | BY Yuyu--
